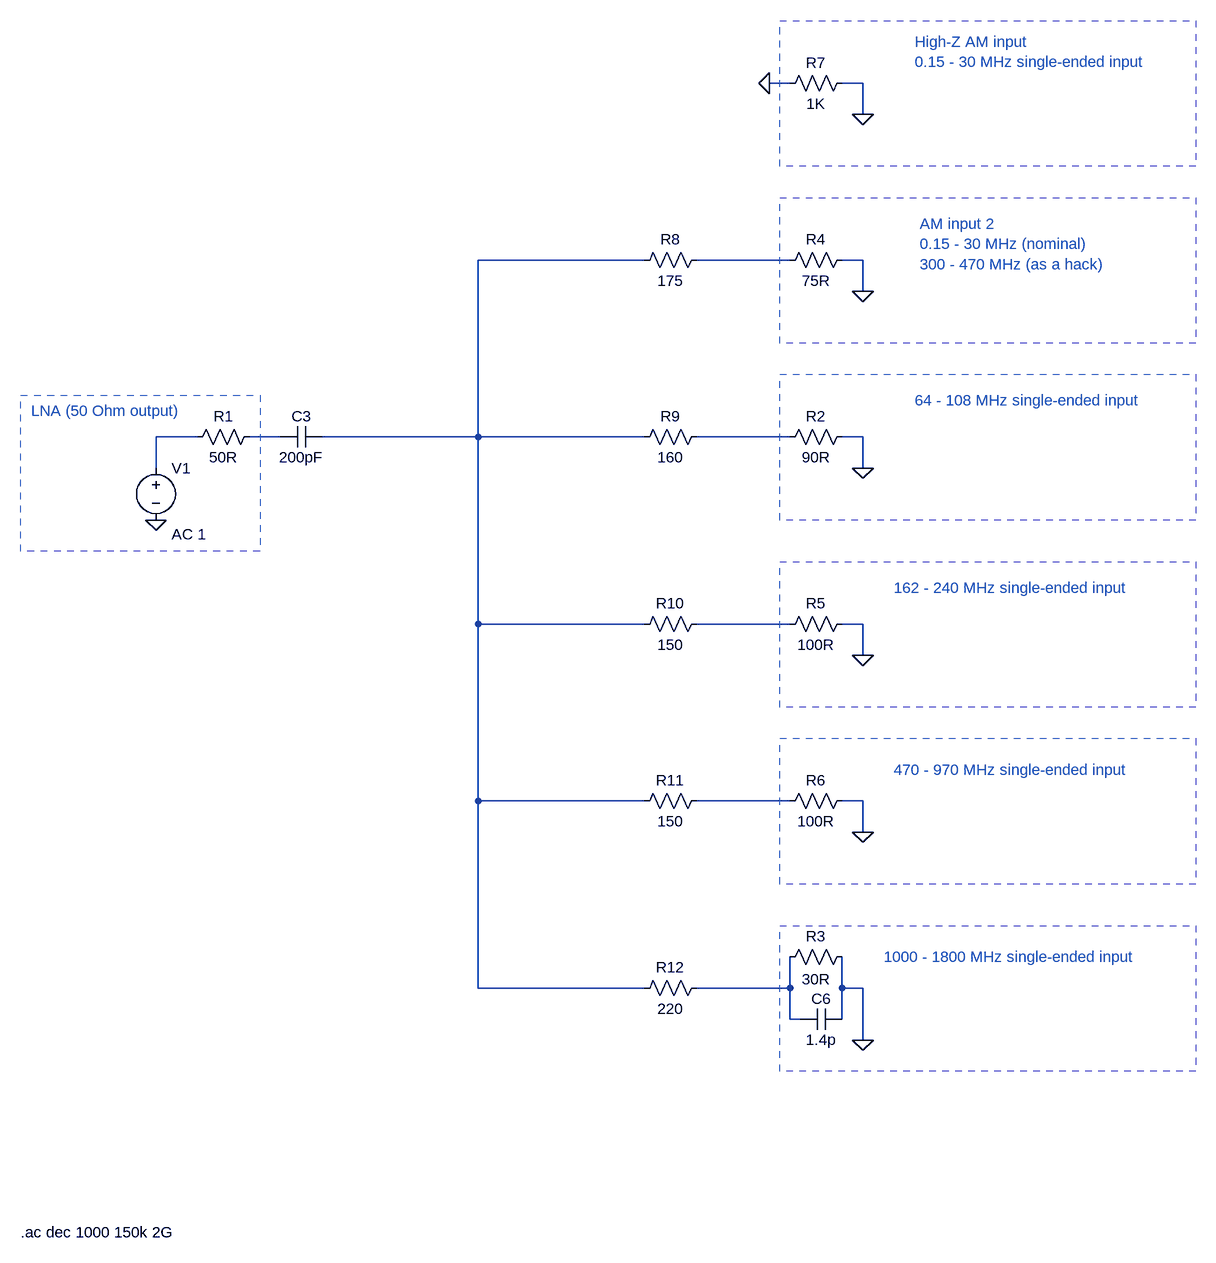
[diagram p0: schematic antenna_input_coupling_resistive.asc]
antenna_input_coupling_resistive.asc, the LTspice schematic file:
Version 4
SHEET 1 1332 1656
WIRE 464 -128 432 -128
WIRE 576 -128 544 -128
WIRE 576 -80 576 -128
WIRE 240 144 -16 144
WIRE 464 144 320 144
WIRE 576 144 544 144
WIRE 576 192 576 144
WIRE -448 416 -512 416
WIRE -320 416 -368 416
WIRE -16 416 -16 144
WIRE -16 416 -256 416
WIRE 240 416 -16 416
WIRE 464 416 320 416
WIRE 576 416 544 416
WIRE -512 464 -512 416
WIRE 576 464 576 416
WIRE -16 704 -16 416
WIRE 240 704 -16 704
WIRE 464 704 320 704
WIRE 576 704 544 704
WIRE 576 752 576 704
WIRE -16 976 -16 704
WIRE 240 976 -16 976
WIRE 464 976 320 976
WIRE 576 976 544 976
WIRE 576 1024 576 976
WIRE -16 1264 -16 976
WIRE 240 1264 -16 1264
WIRE 464 1264 464 1216
WIRE 464 1264 320 1264
WIRE 544 1264 544 1216
WIRE 576 1264 544 1264
WIRE 464 1312 464 1264
WIRE 480 1312 464 1312
WIRE 544 1312 544 1264
WIRE 576 1344 576 1264
FLAG -512 544 0
FLAG 576 464 0
FLAG 576 752 0
FLAG 576 1024 0
FLAG 576 1344 0
FLAG 576 192 0
FLAG 576 -80 0
FLAG 432 -128 0
SYMBOL res -352 400 R90
WINDOW 0 0 56 VBottom 2
WINDOW 3 32 56 VTop 2
SYMATTR InstName R1
SYMATTR Value 50R
SYMBOL voltage -512 448 R0
WINDOW 123 24 118 Left 2
SYMATTR Value2 AC 1
SYMATTR InstName V1
SYMATTR Value ""
SYMBOL res 560 400 R90
WINDOW 0 0 56 VBottom 2
WINDOW 3 32 56 VTop 2
SYMATTR InstName R2
SYMATTR Value 90R
SYMBOL res 560 688 R90
WINDOW 0 0 56 VBottom 2
WINDOW 3 32 56 VTop 2
SYMATTR InstName R5
SYMATTR Value 100R
SYMBOL res 560 960 R90
WINDOW 0 0 56 VBottom 2
WINDOW 3 32 56 VTop 2
SYMATTR InstName R6
SYMATTR Value 100R
SYMBOL res 560 1200 R90
WINDOW 0 0 56 VBottom 2
WINDOW 3 35 56 VTop 2
SYMATTR InstName R3
SYMATTR Value 30R
SYMBOL res 560 128 R90
WINDOW 0 0 56 VBottom 2
WINDOW 3 32 56 VTop 2
SYMATTR InstName R4
SYMATTR Value 75R
SYMBOL res 560 -144 R90
WINDOW 0 0 56 VBottom 2
WINDOW 3 32 56 VTop 2
SYMATTR InstName R7
SYMATTR Value 1K
SYMBOL cap 480 1328 R270
WINDOW 0 32 32 VTop 2
WINDOW 3 0 32 VBottom 2
SYMATTR InstName C6
SYMATTR Value 1.4p
SYMBOL cap -256 400 R90
WINDOW 0 0 32 VBottom 2
WINDOW 3 32 32 VTop 2
SYMATTR InstName C3
SYMATTR Value 200pF
SYMBOL res 336 128 R90
WINDOW 0 0 56 VBottom 2
WINDOW 3 32 56 VTop 2
SYMATTR InstName R8
SYMATTR Value 175
SYMBOL res 336 400 R90
WINDOW 0 0 56 VBottom 2
WINDOW 3 32 56 VTop 2
SYMATTR InstName R9
SYMATTR Value 160
SYMBOL res 336 688 R90
WINDOW 0 0 56 VBottom 2
WINDOW 3 32 56 VTop 2
SYMATTR InstName R10
SYMATTR Value 150
SYMBOL res 336 960 R90
WINDOW 0 0 56 VBottom 2
WINDOW 3 32 56 VTop 2
SYMATTR InstName R11
SYMATTR Value 150
SYMBOL res 336 1248 R90
WINDOW 0 0 56 VBottom 2
WINDOW 3 32 56 VTop 2
SYMATTR InstName R12
SYMATTR Value 220
TEXT -720 1640 Left 2 !.ac dec 1000 150k 2G
TEXT -704 376 Left 2 ;LNA (50 Ohm output)
TEXT 656 360 Left 2 ;64 - 108 MHz single-ended input
TEXT 624 648 Left 2 ;162 - 240 MHz single-ended input
TEXT 624 928 Left 2 ;470 - 970 MHz single-ended input
TEXT 608 1216 Left 2 ;1000 - 1800 MHz single-ended input
TEXT 664 88 Left 2 ;AM input 2\n0.15 - 30 MHz (nominal)\n300 - 470 MHz (as a hack)
TEXT 656 -192 Left 2 ;High-Z AM input\n0.15 - 30 MHz single-ended input
RECTANGLE Normal -720 352 -352 592 2
RECTANGLE Normal 1088 544 448 320 2
RECTANGLE Normal 1088 832 448 608 2
RECTANGLE Normal 1088 1104 448 880 2
RECTANGLE Normal 1088 1392 448 1168 2
RECTANGLE Normal 1088 272 448 48 2
RECTANGLE Normal 1088 0 448 -224 2

The netlist it stands for:
* antenna_input_coupling_resistive.asc
R1 N004 N003 50R
V1 N003 0 AC 1
R2 0 N005 90R
R5 0 N006 100R
R6 0 N007 100R
R3 0 N008 30R
R4 0 N002 75R
R7 0 0 1K
C6 N008 0 1.4p
C3 N001 N004 200pF
R8 N002 N001 175
R9 N005 N001 160
R10 N006 N001 150
R11 N007 N001 150
R12 N008 N001 220
.ac dec 1000 150k 2G
* LNA (50 Ohm output)
* 64 - 108 MHz single-ended input
* 162 - 240 MHz single-ended input
* 470 - 970 MHz single-ended input
* 1000 - 1800 MHz single-ended input
* AM input 2
* 0.15 - 30 MHz (nominal)
* 300 - 470 MHz (as a hack)
* High-Z AM input
* 0.15 - 30 MHz single-ended input
.backanno
.end